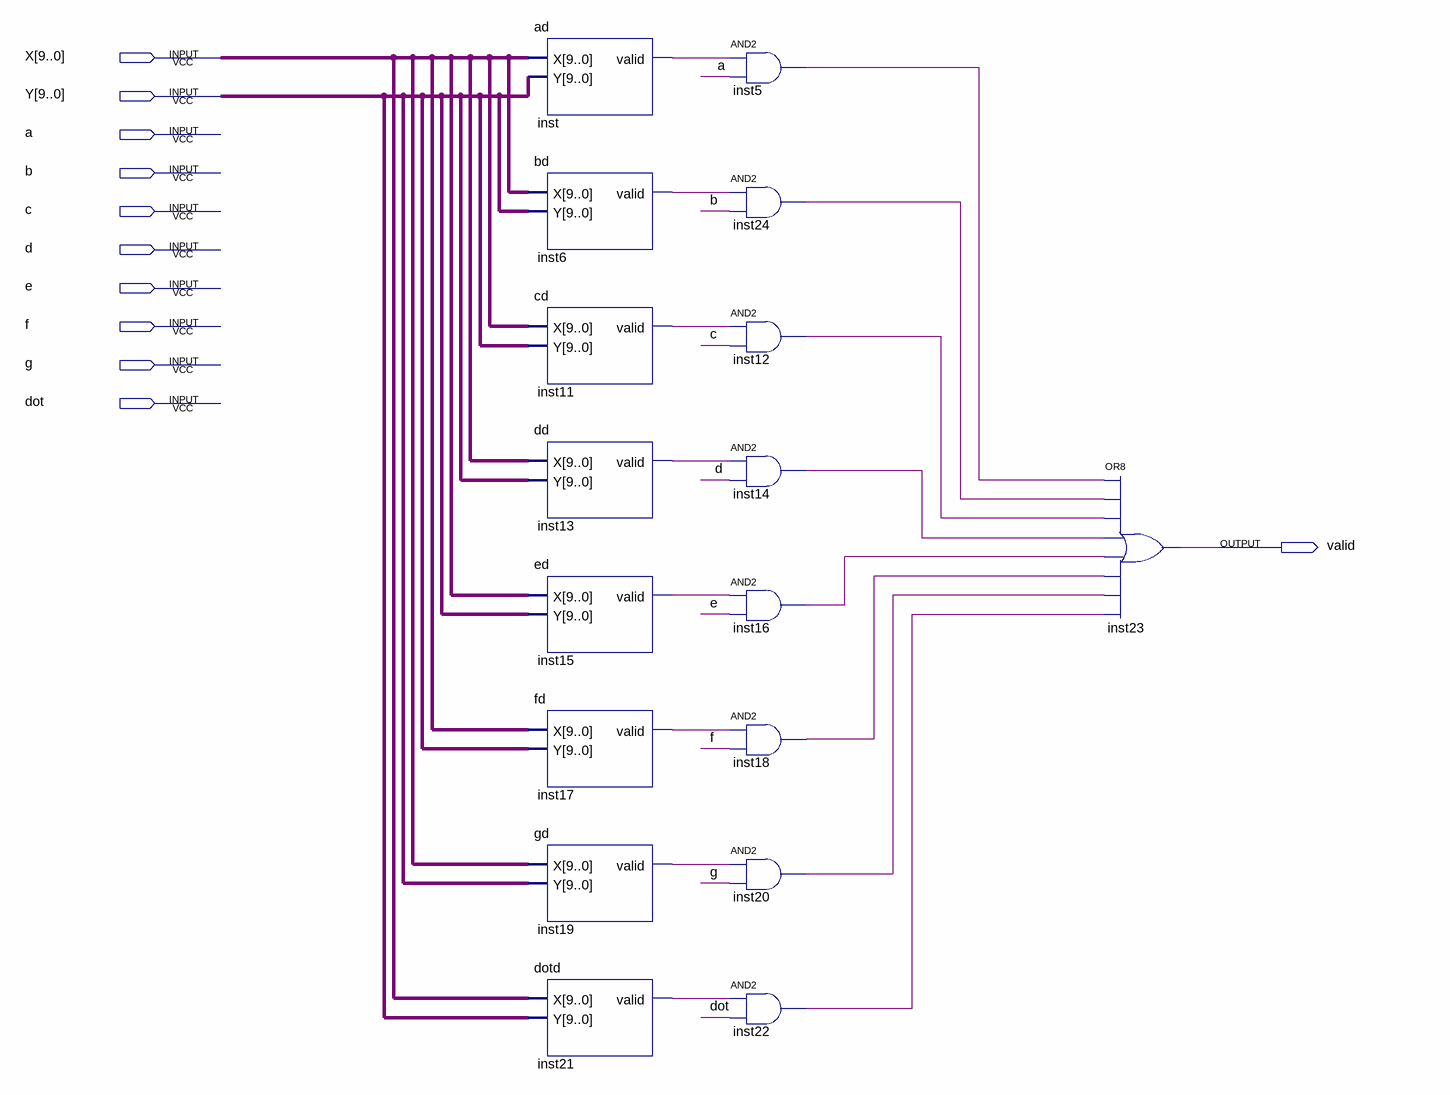
[diagram p0: schematic sheet]
// Quartus schematic SedmoSegmentniD.bdf as structural Verilog: 17 symbols, 11 pins
module SedmoSegmentniD (
  input  [9:0] X,
  input  [9:0] Y,
  input  a,
  input  b,
  input  c,
  input  d,
  input  e,
  input  f,
  input  g,
  input  dot,
  output valid
);

  wire inst5_out, inst6_valid, inst11_valid, inst12_out, inst13_valid, inst14_out, inst15_valid, inst16_out,
       inst17_valid, inst18_out, inst19_valid, inst20_out, inst21_valid, inst22_out, inst24_out, inst_valid;

  ad inst (.X(X), .Y(Y), .valid(inst_valid));
  bd inst6 (.X(X), .Y(Y), .valid(inst6_valid));
  cd inst11 (.X(X), .Y(Y), .valid(inst11_valid));
  dd inst13 (.X(X), .Y(Y), .valid(inst13_valid));
  ed inst15 (.X(X), .Y(Y), .valid(inst15_valid));
  fd inst17 (.X(X), .Y(Y), .valid(inst17_valid));
  gd inst19 (.X(X), .Y(Y), .valid(inst19_valid));
  dotd inst21 (.X(X), .Y(Y), .valid(inst21_valid));
  and inst5 (inst5_out, inst_valid, a);
  and inst24 (inst24_out, inst6_valid, b);
  and inst12 (inst12_out, inst11_valid, c);
  and inst14 (inst14_out, inst13_valid, d);
  and inst16 (inst16_out, inst15_valid, e);
  and inst18 (inst18_out, inst17_valid, f);
  and inst20 (inst20_out, inst19_valid, g);
  and inst22 (inst22_out, inst21_valid, dot);
  or inst23 (valid, inst5_out, inst24_out, inst12_out, inst14_out, inst16_out, inst18_out, inst20_out, inst22_out);
endmodule
